# EAGLE design Measure-01 (EAGLE 6.2)
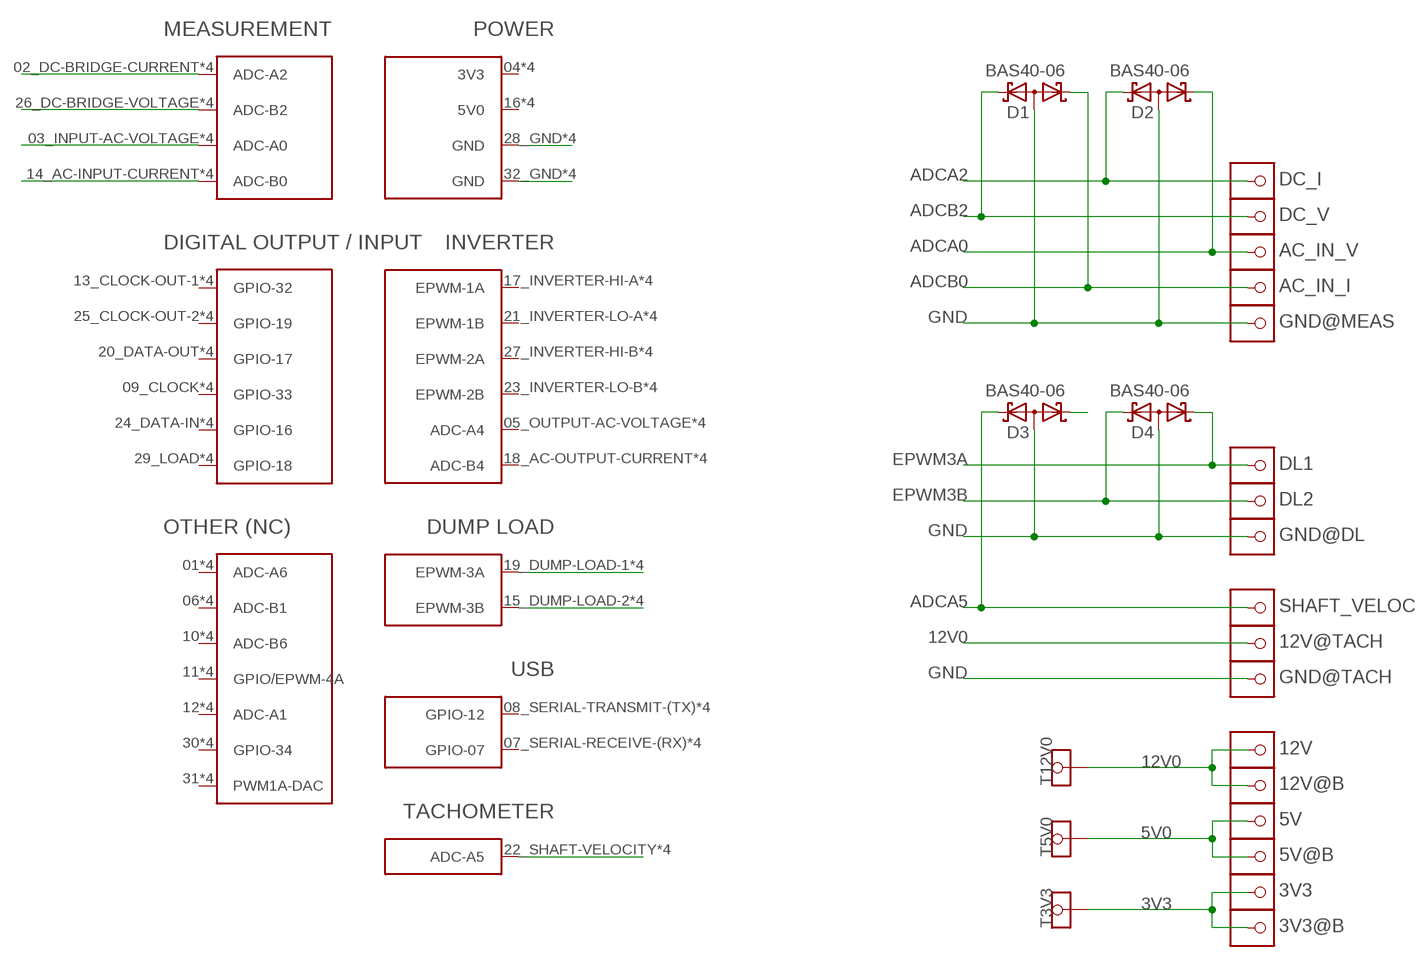
[diagram p0: schematic, sheet 1]

## Parts
3V3  1X1STACK  [1X1STACK]
3V3@B  1X1STACK  [1X1STACK]
5V  1X1STACK  [1X1STACK]
5V@B  1X1STACK  [1X1STACK]
12V  1X1STACK  [1X1STACK]
12V@B  1X1STACK  [1X1STACK]
12V@TACH  1X1HEADER(W/VIA)  [1X1HEADER(W/VIA)]
AC_IN_I  1X1HEADER(W/VIA)  [1X1HEADER(W/VIA)]
AC_IN_V  1X1HEADER(W/VIA)  [1X1HEADER(W/VIA)]
D1  BAS40-06  [SOT23]
D2  BAS40-06  [SOT23]
D3  BAS40-06  [SOT23]
D4  BAS40-06  [SOT23]
DC_I  1X1HEADER(W/VIA)  [1X1HEADER(W/VIA)]
DC_V  1X1HEADER(W/VIA)  [1X1HEADER(W/VIA)]
DL1  1X1HEADER(W/VIA)  [1X1HEADER(W/VIA)]
DL2  1X1HEADER(W/VIA)  [1X1HEADER(W/VIA)]
GND@DL  1X1HEADER(W/VIA)  [1X1HEADER(W/VIA)]
GND@MEAS  1X1HEADER(W/VIA)  [1X1HEADER(W/VIA)]
GND@TACH  1X1HEADER(W/VIA)  [1X1HEADER(W/VIA)]
SHAFT_VELOC  1X1HEADER(W/VIA)  [1X1HEADER(W/VIA)]
T3V3  TESTPAD  [TESTPAD]
T5V0  TESTPAD  [TESTPAD]
T12V0  TESTPAD  [TESTPAD]
U$1  CONTROLLER_STACK  [CONTROLLER_STACK]

## Nets
3V3: 3V3.P$2 3V3.P$5 3V3.P$58 3V3.P$65 3V3.PAD 3V3@B.P$2 3V3@B.P$5 3V3@B.P$58 3V3@B.P$65 3V3@B.PAD T3V3.TP
5V0: 5V.P$2 5V.P$5 5V.P$58 5V.P$65 5V.PAD 5V@B.P$2 5V@B.P$5 5V@B.P$58 5V@B.P$65 5V@B.PAD T5V0.TP
12V0: 12V.P$2 12V.P$5 12V.P$58 12V.P$65 12V.PAD 12V@B.P$2 12V@B.P$5 12V@B.P$58 12V@B.P$65 12V@B.PAD 12V@TACH.P$2 12V@TACH.P$3 12V@TACH.P$4 12V@TACH.PAD T12V0.TP
ADCA0: AC_IN_V.P$2 AC_IN_V.P$3 AC_IN_V.P$4 AC_IN_V.PAD D2.1(K1) U$1.03_INPUT-AC-VOLTAGE(ADC-A0) U$1.A3(ADC-A0) U$1.B3(ADC-A0) U$1.C3(ADC-A0)
ADCA2: D2.2(K2) DC_I.P$2 DC_I.P$3 DC_I.P$4 DC_I.PAD U$1.02_DC-BRIDGE-CURRENT(ADC-A2) U$1.A2(ADC-A2) U$1.B2(ADC-A2) U$1.C2(ADC-A2)
ADCA5: D3.2(K2) SHAFT_VELOC.P$2 SHAFT_VELOC.P$3 SHAFT_VELOC.P$4 SHAFT_VELOC.PAD U$1.22_SHAFT-VELOCITY(ADC-A5) U$1.A22(ADC-A5) U$1.B22(ADC-A5) U$1.C22(ADC-A5)
ADCB0: AC_IN_I.P$2 AC_IN_I.P$3 AC_IN_I.P$4 AC_IN_I.PAD D1.1(K1) U$1.14_AC-INPUT-CURRENT(ADC-B0) U$1.A14(ADC-B0) U$1.B14(ADC-B0) U$1.C14(ADC-B0)
ADCB2: D1.2(K2) DC_V.P$2 DC_V.P$3 DC_V.P$4 DC_V.PAD U$1.26_DC-BRIDGE-VOLTAGE(ADC-B2) U$1.A26(ADC-B2) U$1.B26(ADC-B2) U$1.C26(ADC-B2)
EPWM3A: D4.1(K1) DL1.P$2 DL1.P$3 DL1.P$4 DL1.PAD U$1.19_DUMP-LOAD-1(EPWM-3A) U$1.A19(EPWM-3A) U$1.B19(EPWM-3A) U$1.C19(EPWM-3A)
EPWM3B: D4.2(K2) DL2.P$2 DL2.P$3 DL2.P$4 DL2.PAD U$1.15_DUMP-LOAD-2(EPWM-3B) U$1.A15(EPWM-3B) U$1.B15(EPWM-3B) U$1.C15(EPWM-3B)
GND: D1.3(AA) D2.3(AA) D3.3(AA) D4.3(AA) GND@DL.P$2 GND@DL.P$3 GND@DL.P$4 GND@DL.PAD GND@MEAS.P$2 GND@MEAS.P$3 GND@MEAS.P$4 GND@MEAS.PAD GND@TACH.P$2 GND@TACH.P$3 GND@TACH.P$4 GND@TACH.PAD U$1.28_GND(GND) U$1.32_GND(GND) U$1.A28(GND) U$1.A32(GND) U$1.B28(GND) U$1.B32(GND) U$1.C28(GND) U$1.C32(GND)
STARTUP: D3.1(K1)
Unconnected: U$1.01(ADC-A6) U$1.04(3V3) U$1.05_OUTPUT-AC-VOLTAGE(ADC-A4) U$1.06(ADC-B1) U$1.07_SERIAL-RECEIVE-(RX)(GPIO-07) U$1.08_SERIAL-TRANSMIT-(TX)(GPIO-12) U$1.09_CLOCK(GPIO-33) U$1.10(ADC-B6) U$1.11(GPIO/EPWM-4A) U$1.12(ADC-A1) U$1.13_CLOCK-OUT-1(GPIO-32) U$1.16(5V0) U$1.17_INVERTER-HI-A(EPWM-1A) U$1.18_AC-OUTPUT-CURRENT(ADC-B4) U$1.20_DATA-OUT(GPIO-17) U$1.21_INVERTER-LO-A(EPWM-1B) U$1.23_INVERTER-LO-B(EPWM-2B) U$1.24_DATA-IN(GPIO-16) U$1.25_CLOCK-OUT-2(GPIO-19) U$1.27_INVERTER-HI-B(EPWM-2A) U$1.29_LOAD(GPIO-18) U$1.30(GPIO-34) U$1.31(PWM1A-DAC) U$1.A1(ADC-A6) U$1.A4(3V3) U$1.A5(ADC-A4) U$1.A6(ADC-B1) U$1.A7(GPIO-07) U$1.A8(GPIO-12) U$1.A9(GPIO-33) U$1.A10(ADC-B6) U$1.A11(GPIO/EPWM-4A) U$1.A12(ADC-A1) U$1.A13(GPIO-32) U$1.A16(5V0) U$1.A17(EPWM-1A) U$1.A18(ADC-B4) U$1.A20(GPIO-17) U$1.A21(EPWM-1B) U$1.A23(EPWM-2B) U$1.A24(GPIO-16) U$1.A25(GPIO-19) U$1.A27(EPWM-2A) U$1.A29(GPIO-18) U$1.A30(GPIO-34) U$1.A31(PWM1A-DAC) U$1.B1(ADC-A6) U$1.B4(3V3) U$1.B5(ADC-A4) U$1.B6(ADC-B1) U$1.B7(GPIO-07) U$1.B8(GPIO-12) U$1.B9(GPIO-33) U$1.B10(ADC-B6) U$1.B11(GPIO/EPWM-4A) U$1.B12(ADC-A1) U$1.B13(GPIO-32) U$1.B16(5V0) U$1.B17(EPWM-1A) U$1.B18(ADC-B4) U$1.B20(GPIO-17) U$1.B21(EPWM-1B) U$1.B23(EPWM-2B) U$1.B24(GPIO-16) U$1.B25(GPIO-19) U$1.B27(EPWM-2A) U$1.B29(GPIO-18) U$1.B30(GPIO-34) U$1.B31(PWM1A-DAC) U$1.C1(ADC-A6) U$1.C4(3V3) U$1.C5(ADC-A4) U$1.C6(ADC-B1) U$1.C7(GPIO-07) U$1.C8(GPIO-12) U$1.C9(GPIO-33) U$1.C10(ADC-B6) U$1.C11(GPIO/EPWM-4A) U$1.C12(ADC-A1) U$1.C13(GPIO-32) U$1.C16(5V0) U$1.C17(EPWM-1A) U$1.C18(ADC-B4) U$1.C20(GPIO-17) U$1.C21(EPWM-1B) U$1.C23(EPWM-2B) U$1.C24(GPIO-16) U$1.C25(GPIO-19) U$1.C27(EPWM-2A) U$1.C29(GPIO-18) U$1.C30(GPIO-34) U$1.C31(PWM1A-DAC)

## Library data of the parts
3V3 3V3@B 5V 5V@B 12V 12V@B = headers v6-2:1X1STACK
12V@TACH AC_IN_I AC_IN_V DC_I DC_V DL1 DL2 GND@DL GND@MEAS GND@TACH SHAFT_VELOC = headers v6-2:1X1HEADER(W/VIA)
D1-D4 = diode:BAS40-06: Silicon Schottky Diodes General-purpose diode for high-speed switching
T3V3 T5V0 T12V0 = PCB_ControlStack:TESTPAD
U$1 = PCB_ControlStack:CONTROLLER_STACK

## Board
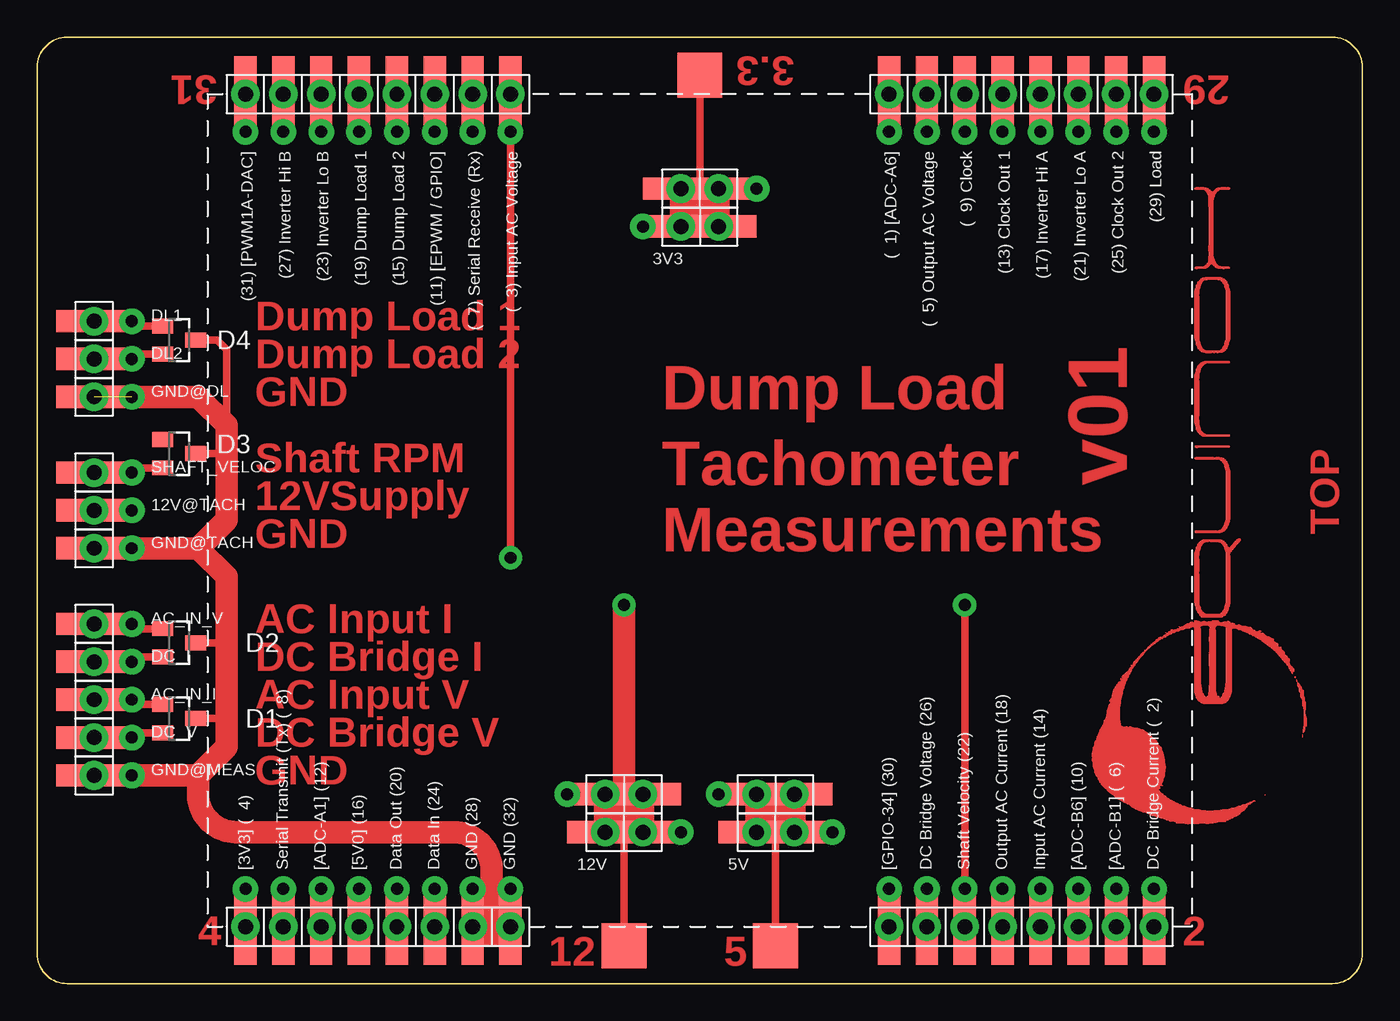
[diagram p1: board, top side]
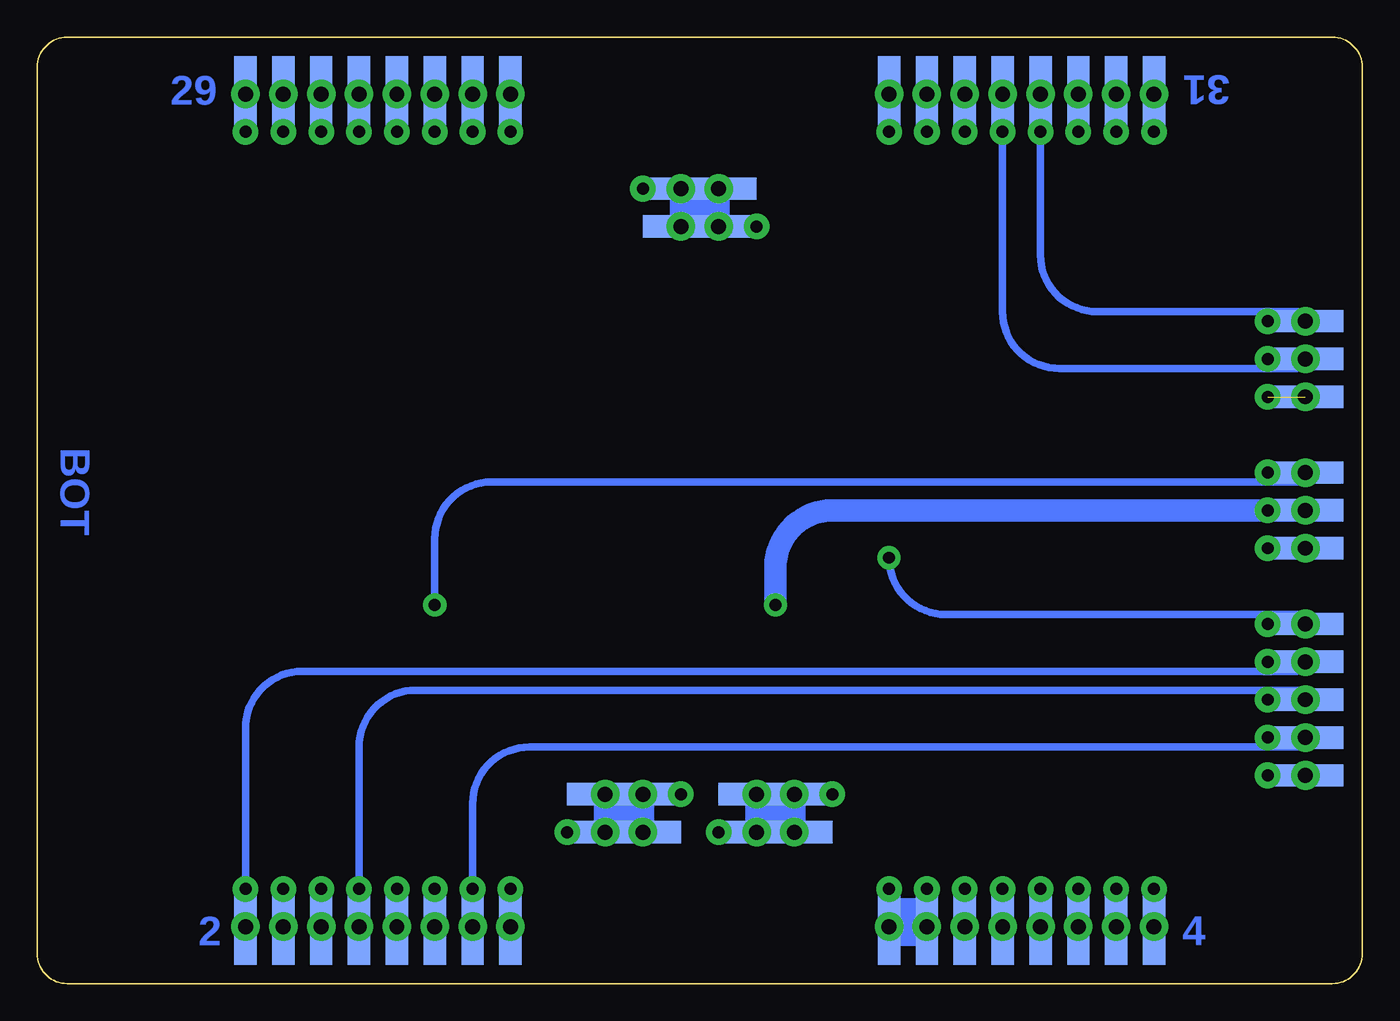
[diagram p2: board, bottom side, seen from below]

Size 88.9 x 63.5 mm. Coordinates in mm from the lower left corner, seen from the top.
Outline: 2,0 86.9,0 arc90 88.9,2 88.9,61.5 arc90 86.9,63.5 2,63.5 arc90 0,61.5 0,2 arc90 2,0
Copper layers (1*16): Top 0.035mm / dielectric 1.5mm / Bottom 0.035mm
Design rules: minimum track width 12mil, minimum drill 0.7mm, track to track 25mil, track to pad 20mil, pad to pad 15mil, via to via 20mil, smd to smd 0mil, copper to edge 40mil, drill to drill 10mil, minimum pad ring 18mil, minimum via ring 15mil, stop-mask expansion 0mil, vias tented up to drill 0mil, thermal gap 15mil
tRestrict: 8 lines
bRestrict: 8 lines

### Footprints (pad centres in the part's own frame; a part is rotated, then mirrored left to right if it is on the bottom)
1X1STACK = drill 1: P$2 -1.27,0; PAD 1.27,0 | drill 0.8: P$5 3.81,0 | smd 7.62 x 1.5 bottom: P$58 0,0 | smd 7.62 x 1.5: P$65 0,0
1X1HEADER(W/VIA) = smd 5.08 x 1.5: P$2 0,0 | smd 5.08 x 1.5 bottom: P$3 0,0 | drill 0.8: P$4 2.54,0 | drill 1: PAD 0,0
SOT23 = smd 1 x 1.4: 1 -0.95,-1.1; 2 0.95,-1.1; 3 0,1.1
TESTPAD = smd 3 x 3: TP 0,0
CONTROLLER_STACK = drill 1: 01 -27.94,12.7; 02_DC-BRIDGE-CURRENT 27.94,30.48; 03_INPUT-AC-VOLTAGE -27.94,-12.7; 04 27.94,-30.48; 05_OUTPUT-AC-VOLTAGE -27.94,15.24; 06 27.94,27.94; 07_SERIAL-RECEIVE-(RX) -27.94,-15.24; 08_SERIAL-TRANSMIT-(TX) 27.94,-27.94; 09_CLOCK -27.94,17.78; 10 27.94,25.4; 11 -27.94,-17.78; 12 27.94,-25.4; 13_CLOCK-OUT-1 -27.94,20.32; 14_AC-INPUT-CURRENT 27.94,22.86; 15_DUMP-LOAD-2 -27.94,-20.32; 16 27.94,-22.86; 17_INVERTER-HI-A -27.94,22.86; 18_AC-OUTPUT-CURRENT 27.94,20.32; 19_DUMP-LOAD-1 -27.94,-22.86; 20_DATA-OUT 27.94,-20.32; 21_INVERTER-LO-A -27.94,25.4; 22_SHAFT-VELOCITY 27.94,17.78; 23_INVERTER-LO-B -27.94,-25.4; 24_DATA-IN 27.94,-17.78; 25_CLOCK-OUT-2 -27.94,27.94; 26_DC-BRIDGE-VOLTAGE 27.94,15.24; 27_INVERTER-HI-B -27.94,-27.94; 28_GND 27.94,-15.24; 29_LOAD -27.94,30.48; 30 27.94,12.7; 31 -27.94,-30.48; 32_GND 27.94,-12.7 | smd 5.08 x 1.5: A1 -27.94,12.7; A2 27.94,30.48; A3 -27.94,-12.7; A4 27.94,-30.48; A5 -27.94,15.24; A6 27.94,27.94; A7 -27.94,-15.24; A8 27.94,-27.94; A9 -27.94,17.78; A10 27.94,25.4; A11 -27.94,-17.78; A12 27.94,-25.4; A13 -27.94,20.32; A14 27.94,22.86; A15 -27.94,-20.32; A16 27.94,-22.86; A17 -27.94,22.86; A18 27.94,20.32; A19 -27.94,-22.86; A20 27.94,-20.32; A21 -27.94,25.4; A22 27.94,17.78; A23 -27.94,-25.4; A24 27.94,-17.78; A25 -27.94,27.94; A26 27.94,15.24; A27 -27.94,-27.94; A28 27.94,-15.24; A29 -27.94,30.48; A30 27.94,12.7; A31 -27.94,-30.48; A32 27.94,-12.7 | smd 5.08 x 1.5 bottom: B1 -27.94,12.7; B2 27.94,30.48; B3 -27.94,-12.7; B4 27.94,-30.48; B5 -27.94,15.24; B6 27.94,27.94; B7 -27.94,-15.24; B8 27.94,-27.94; B9 -27.94,17.78; B10 27.94,25.4; B11 -27.94,-17.78; B12 27.94,-25.4; B13 -27.94,20.32; B14 27.94,22.86; B15 -27.94,-20.32; B16 27.94,-22.86; B17 -27.94,22.86; B18 27.94,20.32; B19 -27.94,-22.86; B20 27.94,-20.32; B21 -27.94,25.4; B22 27.94,17.78; B23 -27.94,-25.4; B24 27.94,-17.78; B25 -27.94,27.94; B26 27.94,15.24; B27 -27.94,-27.94; B28 27.94,-15.24; B29 -27.94,30.48; B30 27.94,12.7; B31 -27.94,-30.48; B32 27.94,-12.7 | drill 0.8: C1 -25.4,12.7; C2 25.4,30.48; C3 -25.4,-12.7; C4 25.4,-30.48; C5 -25.4,15.24; C6 25.4,27.94; C7 -25.4,-15.24; C8 25.4,-27.94; C9 -25.4,17.78; C10 25.4,25.4; C11 -25.4,-17.78; C12 25.4,-25.4; C13 -25.4,20.32; C14 25.4,22.86; C15 -25.4,-20.32; C16 25.4,-22.86; C17 -25.4,22.86; C18 25.4,20.32; C19 -25.4,-22.86; C20 25.4,-20.32; C21 -25.4,25.4; C22 25.4,17.78; C23 -25.4,-25.4; C24 25.4,-17.78; C25 -25.4,27.94; C26 25.4,15.24; C27 -25.4,-27.94; C28 25.4,-15.24; C29 -25.4,30.48; C30 25.4,12.7; C31 -25.4,-30.48; C32 25.4,-12.7

### Placement (x,y rotation side)
3V3  44.45,53.34 0 top
3V3@B  44.45,50.8 180 top
5V  49.53,10.16 0 top
5V@B  49.53,12.7 180 top
12V  39.37,10.16 0 top
12V@B  39.37,12.7 180 top
12V@TACH  3.81,31.75 0 top
AC_IN_I  3.81,19.05 0 top
AC_IN_V  3.81,24.13 0 top
D1  9.53,17.78 270 top
D2  9.53,22.86 270 top
D3  9.53,35.56 270 top
D4  9.53,43.18 270 top
DC_I  3.81,21.59 0 top
DC_V  3.81,16.51 0 top
DL1  3.81,44.45 0 top
DL2  3.81,41.91 0 top
GND@DL  3.81,39.37 0 top
GND@MEAS  3.81,13.97 0 top
GND@TACH  3.81,29.21 0 top
SHAFT_VELOC  3.81,34.29 0 top
T3V3  44.45,60.96 0 top
T5V0  49.53,2.54 180 top
T12V0  39.37,2.54 180 top
U$1  44.45,31.75 270 top

### Tracks (layer width: path | path; a pad name or v marks a point on that pad's centre or on a via)
3V3
  Top 0.5: T3V3.TP 3V3@B.P$65
  Top 1.5: 3V3@B.P$5 3V3@B.PAD | 3V3.P$5 3V3.PAD | 3V3.PAD 3V3.P$65 | 3V3.P$2 3V3@B.PAD | 3V3@B.PAD 3V3@B.P$65 3V3@B.P$2 3V3.PAD
  Bottom 1.5: 3V3@B.P$65 3V3@B.PAD | 3V3@B.PAD 3V3@B.P$5 | 3V3.P$65 3V3.PAD | 3V3.PAD 3V3.P$5 | 3V3.P$2 3V3@B.PAD | 3V3@B.P$2 3V3.PAD
5V0
  Top 0.5: T5V0.TP 5V@B.P$65
  Top 1.5: 5V@B.P$5 5V@B.PAD | 5V.P$5 5V.PAD | 5V.PAD 5V.P$65 | 5V.P$2 5V@B.PAD | 5V@B.PAD 5V@B.P$65 5V@B.P$2 5V.PAD
  Bottom 1.5: 5V@B.P$65 5V@B.PAD | 5V@B.PAD 5V@B.P$5 | 5V.P$65 5V.PAD | 5V.PAD 5V.P$5 | 5V@B.PAD 5V.P$2 | 5V@B.P$2 5V.PAD
12V0  (via drill 0.8)
  Top 0.5: T12V0.TP 12V.P$65 12V@B.P$65
  Top 1.5: 12V@B.PAD 12V@B.P$5 | 12V.P$5 12V.PAD | 12V.PAD 12V.P$65 v39.37,25.4 | 12V.P$2 12V@B.PAD | 12V@B.PAD 12V@B.P$65 12V@B.P$2 12V.PAD
  Bottom 1.5: 12V@B.P$65 12V@B.PAD | 12V@B.PAD 12V@B.P$5 | 12V.P$65 12V.PAD | 12V.PAD 12V.P$5 | 12V.P$2 12V@B.PAD | 12V.PAD 12V@B.P$2 | 12V@TACH.PAD 12V@TACH.P$4 35.56,31.75 arc-90 39.37,27.94 v39.37,25.4
ADCA0  (via drill 0.8)
  Top 0.5: v31.75,28.57 U$1.C3 U$1.03_INPUT-AC-VOLTAGE | D2.1 4.13,23.81 arc-90 AC_IN_V.PAD
  Bottom 0.5: 6.99,24.77 27.94,24.77 arc90 v31.75,28.57 | 6.99,24.77 arc90 AC_IN_V.P$4 | 6.99,24.77 4.45,24.77 arc90 AC_IN_V.PAD
ADCA2
  Top 0.5: D2.2 4.13,21.91 arc90 DC_I.PAD
  Bottom 0.5: 6.99,20.95 71.12,20.95 arc-90 74.93,17.14 U$1.C2 U$1.B2 | 6.99,20.95 arc-90 DC_I.P$4 | 6.99,20.95 4.45,20.95 arc-90 DC_I.PAD
ADCA5  (via drill 0.8)
  Top 0.5: D3.2 4.13,34.61 arc90 SHAFT_VELOC.PAD | v62.23,25.4 U$1.C22 U$1.A22
  Bottom 0.5: 6.99,33.66 58.42,33.66 arc-90 62.23,29.84 v62.23,25.4 | 6.99,33.66 arc-90 SHAFT_VELOC.P$4 | 6.99,33.66 4.45,33.66 arc-90 SHAFT_VELOC.PAD
ADCB0
  Top 0.5: D1.1 4.13,18.73 arc-90 AC_IN_I.PAD
  Bottom 0.5: AC_IN_I.P$4 arc-90 6.99,19.68 | 6.99,19.68 63.5,19.68 arc-90 67.31,15.88 U$1.C14 U$1.A14 | 6.99,19.68 4.45,19.68 arc90 AC_IN_I.PAD
ADCB2
  Top 0.5: D1.2 4.13,16.83 arc90 DC_V.PAD
  Bottom 0.5: DC_V.P$4 arc90 6.99,15.88 | 6.99,15.88 55.88,15.88 arc-90 59.69,12.06 U$1.C26 U$1.A26 | 6.99,15.88 4.45,15.88 arc-90 DC_V.PAD
EPWM3A
  Top 0.5: U$1.C19 U$1.B19 | D4.1 4.13,44.13 arc-90 DL1.PAD
  Bottom 0.5: 6.99,45.09 17.78,45.09 arc90 21.59,48.9 U$1.C19 | 6.99,45.09 arc90 DL1.P$4 | 6.99,45.09 4.45,45.09 arc90 DL1.PAD
EPWM3B
  Top 0.5: U$1.C15 U$1.B15 | D4.2 4.13,42.23 arc90 DL2.PAD
  Bottom 0.5: 6.99,41.27 20.32,41.27 arc90 24.13,45.09 U$1.C15 | 6.99,41.27 arc-90 DL2.P$4 | 6.99,41.27 4.45,41.27 arc-90 DL2.PAD
GND  (1 unrouted)
  Top 0.5: D1.3 12.7,17.78 | D3.3 12.7,35.56 | D2.3 12.7,22.86 | D4.3 12.06,43.18 12.7,42.55 12.7,37.47
  Top 1.5: GND@MEAS.PAD GND@MEAS.P$4 10.79,13.97 | U$1.C28 U$1.A28 30.48,3.81 | 10.79,29.21 12.7,27.3 12.7,22.86 12.7,17.78 12.7,15.88 10.79,13.97 | GND@TACH.PAD GND@TACH.P$4 10.79,29.21 | GND@DL.P$4 10.79,39.37 12.7,37.47 12.7,35.56 12.7,31.11 10.79,29.21 | U$1.C32 U$1.B32 30.48,3.81 | 30.48,3.81 30.48,7.62 arc90 27.94,10.16 13.34,10.16 arc-90 10.79,12.7 10.79,13.97
  Bottom 1.5: 30.48,3.81 U$1.A28
(copper drawn outside any net)
  shapes: Bottom area x4, Top area x2022

### Text on the board
Top: 3.3 | Dump Load 1 | Dump Load 2 | Dump Load | GND | v01 | Tachometer | Shaft RPM | TOP | 12VSupply | Measurements | GND | AC Input I | DC Bridge I | AC Input V | DC Bridge V | GND | 12 | 5
Bottom: 31 | BOT